# Altium schematic sheet 1_P1.schdoc
size 429 x 307 mm; Symbol: Drawing-Symbol_A4; Device: Drawing-Symbol_A4; @Project Name: TDA1541A Daughter Board; @Page Count: 1; @Update Date: 2025-07-17; @Create Date: 2025-07-01; @Schematic Name: Schematic1; @Page No: 1; @Page Name: P1; Company: EasyEDA.com; Version: V1.0; Page Size: A4; @Create Time: 10:05:30; @Update Time: 12:09:15; Width: 1655; Height: 1170; Region Start: 1; X Region Count: 6; Y Region Count: 4; Blade Width: 10; Title Block Position: 3; @Board Name: Board1
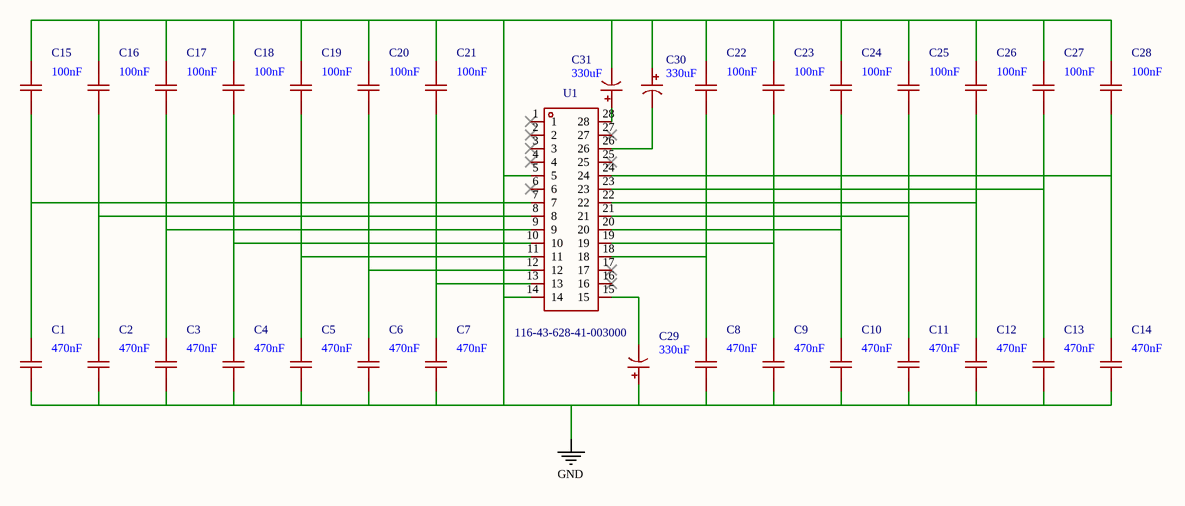
[diagram p0: 1_P1.schdoc]

## Parts
C1  470nF  [CAP-TH_L7.2-W3.5-P5.00-D0.5]
C2  470nF  [CAP-TH_L7.2-W3.5-P5.00-D0.5]
C3  470nF  [CAP-TH_L7.2-W3.5-P5.00-D0.5]
C4  470nF  [CAP-TH_L7.2-W3.5-P5.00-D0.5]
C5  470nF  [CAP-TH_L7.2-W3.5-P5.00-D0.5]
C6  470nF  [CAP-TH_L7.2-W3.5-P5.00-D0.5]
C7  470nF  [CAP-TH_L7.2-W3.5-P5.00-D0.5]
C8  470nF  [CAP-TH_L7.2-W3.5-P5.00-D0.5]
C9  470nF  [CAP-TH_L7.2-W3.5-P5.00-D0.5]
C10  470nF  [CAP-TH_L7.2-W3.5-P5.00-D0.5]
C11  470nF  [CAP-TH_L7.2-W3.5-P5.00-D0.5]
C12  470nF  [CAP-TH_L7.2-W3.5-P5.00-D0.5]
C13  470nF  [CAP-TH_L7.2-W3.5-P5.00-D0.5]
C14  470nF  [CAP-TH_L7.2-W3.5-P5.00-D0.5]
C15  100nF  [C0805]
C16  100nF  [C0805]
C17  100nF  [C0805]
C18  100nF  [C0805]
C19  100nF  [C0805]
C20  100nF  [C0805]
C21  100nF  [C0805]
C22  100nF  [C0805]
C23  100nF  [C0805]
C24  100nF  [C0805]
C25  100nF  [C0805]
C26  100nF  [C0805]
C27  100nF  [C0805]
C28  100nF  [C0805]
C29  330uF  [CAP-TH_BD10.0-P5.00-D1.0-FD]
C30  330uF  [CAP-TH_BD10.0-P5.00-D1.0-FD]
C31  330uF  [CAP-TH_BD10.0-P5.00-D1.0-FD]
U1  116-43-628-41-003000  [116-XX-628-41-003000]

## Nets
GND: C1.1 C2.1 C3.1 C4.1 C5.1 C6.1 C7.1 C8.1 C9.1 C10.1 C11.1 C12.1 C13.1 C14.1 C15.2 C16.2 C17.2 C18.2 C19.2 C20.2 C21.2 C22.2 C23.2 C24.2 C25.2 C26.2 C27.2 C28.2 C29.1 C30.1 C31.2 U1.5 U1.14
NetC1_2: C1.2 C15.1 U1.7
NetC2_2: C2.2 C16.1 U1.8
NetC3_2: C3.2 C17.1 U1.9
NetC4_2: C4.2 C18.1 U1.10
NetC5_2: C5.2 C19.1 U1.11
NetC6_2: C6.2 C20.1 U1.12
NetC7_2: C7.2 C21.1 U1.13
NetC8_2: C8.2 C22.1 U1.18
NetC9_2: C9.2 C23.1 U1.19
NetC10_2: C10.2 C24.1 U1.20
NetC11_2: C11.2 C25.1 U1.21
NetC12_2: C12.2 C26.1 U1.22
NetC13_2: C13.2 C27.1 U1.23
NetC14_2: C14.2 C28.1 U1.24
NetC29_2: C29.2 U1.15
NetC30_2: C30.2 U1.26
NetC31_1: C31.1 U1.28

Not connected (* = marked no-connect by the designer): U1 1* 2* 3* 4* 6* 16* 17* 25* 27*

## Notes on the sheet
- 1
- 2
- 3
- 4
- 5
- 6
- A
- B
- C
- Schematic
- Schematic1
- Create at
- Update at
- 2025-07-01
- 2025-07-17
- D
- Board
- Drawn
- Board1
- Page
- P1
- Reviewed
- Version
- Size
- TDA1541A Daughter Board
- Page  1  Total  1
- V1.0
- A4
- EasyEDA.com

## Library data of the parts
C1-C14 = MKS2C034701C00KSSD: Manufacturer: WIMA; Add into BOM: yes; Tolerance: ±10%; Dielectric Material: Metallized Polyester; Symbol: MKS2C034701C00KSSD; Device: MKS2C034701C00KSSD; LCSC Part Name: 470nF ±10% 63V; Supplier Part: C125837; Manufacturer Part: MKS2C034701C00KSSD; Supplier Footprint: 插件,P=5mm; JLCPCB Part Class: Extended Part; Datasheet: https://atta.szlcsc.com/upload/public/pdf/source/20170818/C125837_1503051198850895197.pdf; Supplier: LCSC; Convert to PCB: yes; Value: 470nF; Operating Temperature: -55℃~+100℃
C15-C28 = CGA4J2X7R2A104KT0Y0U: Manufacturer: TDK; Add into BOM: yes; Tolerance: ±10%; Voltage Rating: 100V; Temperature Coefficient: X7R; Symbol: CGA4J2X7R2A104KT0Y0U; Device: CGA4J2X7R2A104KT0Y0U; LCSC Part Name: 100nF ±10% 100V; Supplier Part: C342919; Manufacturer Part: CGA4J2X7R2A104KT0Y0U; Supplier Footprint: 0805; JLCPCB Part Class: Extended Part; Datasheet: https://atta.szlcsc.com/upload/public/pdf/source/20190522/C342796_4877438410E1AEC415498F5A813EF255.pdf; Supplier: LCSC; Convert to PCB: yes; Value: 100nF
C29-C31 = APSG250ELL331MJB5S: Manufacturer: NCC(日本贵弥功); Add into BOM: yes; Tolerance: ±20%; Voltage Rating: 25V; Ripple Current: 5A@100kHz; Equivalent Series Resistance(ESR): 14mΩ@100kHz; Pin Spacing: 5mm; Lifetime: 20000hrs@105℃; Symbol: APSG250ELL331MJB5S; Device: APSG250ELL331MJB5S; LCSC Part Name: 330uF ±20% 25V; Supplier Part: C133439; Manufacturer Part: APSG250ELL331MJB5S; Supplier Footprint: 插件,D10xL11.5mm; JLCPCB Part Class: Extended Part; Datasheet: https://atta.szlcsc.com/upload/public/pdf/source/20171023/C133441_15087452686851052350.pdf; Supplier: LCSC; Convert to PCB: yes; Value: 330uF; Type: -; Diameter: 10mm; Height - Seated (Max): 11.5mm; Operating Temperature: -55℃~+105℃
U1 = 116-83-628-41-006101: Manufacturer: Mill-Max; Add into BOM: yes; Symbol: 116-83-628-41-006101; Device: 116-83-628-41-006101; Convert to PCB: yes; Manufacturer Part: 116-43-628-41-003000; Supplier: Mouser; Supplier Part: 575-11643628410030; URL: https://eu.mouser.com/ProductDetail/Mill-Max/116-43-628-41-003000?qs=KOdaDPWVOUYHGRVUD167DA%3D%3D; Datasheet: https://4donline.ihs.com/images/VipMasterIC/IC/MMMC/MMMC-S-A0000089115/MMMC-S-A0000089115-1.pdf?hkey=CECEF36DEECDED6468708AAF2E19C0C6